# Altium project CO2 Daughter Board.PrjPcb
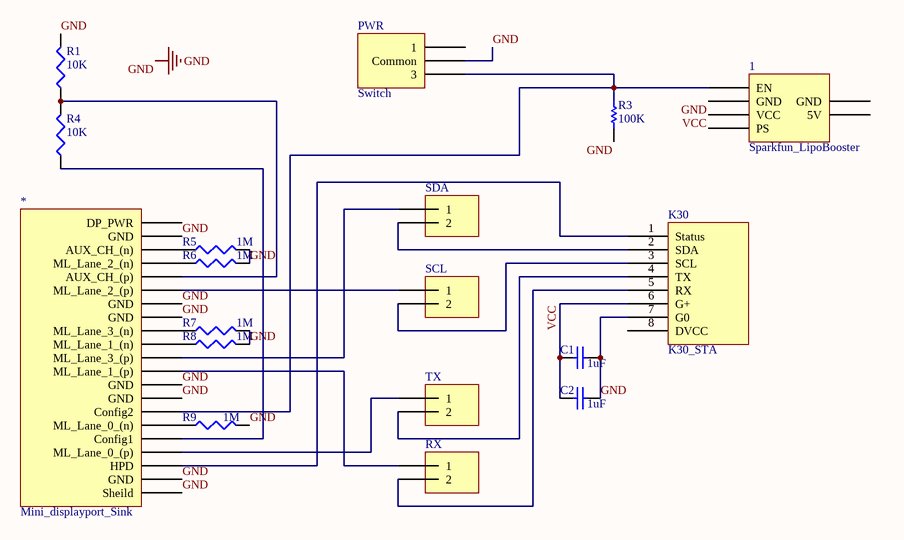
[diagram p0: Schematic_Daughter_Board.SchDoc]
1 sheet, 18 parts. Net scope: global (net labels, ports and power ports of the same name join across sheets).
Board file: Daughter_Board.PcbDoc

## Sheet Schematic_Daughter_Board.SchDoc
size A

### Parts
1  Sparkfun_LipoBooster  [Sparkfun_lipoBooster]
*  Mini_displayport_Sink  [CONN_Displayport]
C1  value 1uF  [C0805]  (hidden comment: Cap Semi)
C2  value 1uF  [C0805]  (hidden comment: Cap Semi)
K30  K30_STA  [K30_STA]
PWR  Switch  [Switch_footprint]
R1  value 10K  [6-0805_N]  (hidden comment: Res3)
R3  value 100K  [AXIAL-0.3]  (hidden comment: Res1)
R4  value 10K  [6-0805_N]  (hidden comment: Res3)
R5  value 1M  [6-0805_N]  (hidden comment: Res3)
R6  value 1M  [6-0805_N]  (hidden comment: Res3)
R7  value 1M  [6-0805_N]  (hidden comment: Res3)
R8  value 1M  [6-0805_N]  (hidden comment: Res3)
R9  value 1M  [6-0805_N]  (hidden comment: Res3)
RX  Solder_Jumper  [Solder_Jumper_Footprint]  (value not drawn)
SCL  Solder_Jumper  [Solder_Jumper_Footprint]  (value not drawn)
SDA  Solder_Jumper  [Solder_Jumper_Footprint]  (value not drawn)
TX  Solder_Jumper  [Solder_Jumper_Footprint]  (value not drawn)

### Nets
GND: 1.2(GND) *.0(Sheild) *.1(GND) *.7(GND) *.8(GND) *.13(GND) *.14(GND) *.19(GND) C1.1 C2.1 K30.7(G0) PWR.2(Common) R1.2 R3.1 R5.2 R6.2 R7.2 R8.2 R9.2
VCC: 1.3(VCC) C1.2 C2.2 K30.6(G+)
Net1_1: 1.1(EN) *.6(Config2) PWR.3 R3.2
Net*_2: *.2(HPD) K30.1(Status)
Net*_3: *.3(ML_Lane_3_(n)) R7.1
Net*_4: *.4(Config1) R4.1
Net*_5: *.5(ML_Lane_3_(p)) SDA.1
Net*_9: *.9(ML_Lane_2_(n)) R6.1
Net*_10: *.10(ML_Lane_0_(n)) R9.1
Net*_11: *.11(ML_Lane_2_(p)) SCL.1
Net*_12: *.12(ML_Lane_0_(p)) TX.1
Net*_15: *.15(ML_Lane_1_(n)) R8.1
Net*_16: *.16(AUX_CH_(p)) R1.1 R4.2
Net*_17: *.17(ML_Lane_1_(p)) RX.1
Net*_18: *.18(AUX_CH_(n)) R5.1
NetK30_2: K30.2(SDA) SDA.2
NetK30_3: K30.3(SCL) SCL.2
NetK30_4: K30.4(TX) TX.2
NetK30_5: K30.5(RX) RX.2

Not connected (* = marked no-connect by the designer): 1 4(PS) 5(5V) 6(GND); * 20(DP_PWR); K30 8(DVCC); PWR 1

### Library data of the parts
C1 C2 = Cap Semi: Capacitor (Semiconductor SIM Model); Published: 8-Jun-2000; LatestRevisionDate: 29-May-2009; LatestRevisionNote: IPC-7351 Footprint Added.; PackageReference: C1206; Publisher: Altium Limited; PackageDescription: Chip Capacitor
R1 R4-R9 = Res3: Resistor; Published: 8-Jun-2000; LatestRevisionDate: 29-May-2009; LatestRevisionNote: IPC-7351 Footprint Added.; PackageReference: J1-0603; Publisher: Altium Limited; PackageDescription: Chip Resistor
R3 = Res1: Resistor; Published: 8-Jun-2000; LatestRevisionDate: 17-Jul-2002; LatestRevisionNote: Re-released for DXP Platform.; PackageReference: AXIAL-0.3; Publisher: Altium Limited; PackageDescription: Axial Device, Thru-Hole; 2 Leads; 0.3 in Pin Spacing